# EasyEDA Pro project AcGunV2.eprj

# Schematic Schematic1
Create Date: 2022-08-31; Page Name: P1; Project Name: AcGunV2; Schematic Name: Schematic1; Update Date: 2022-12-06
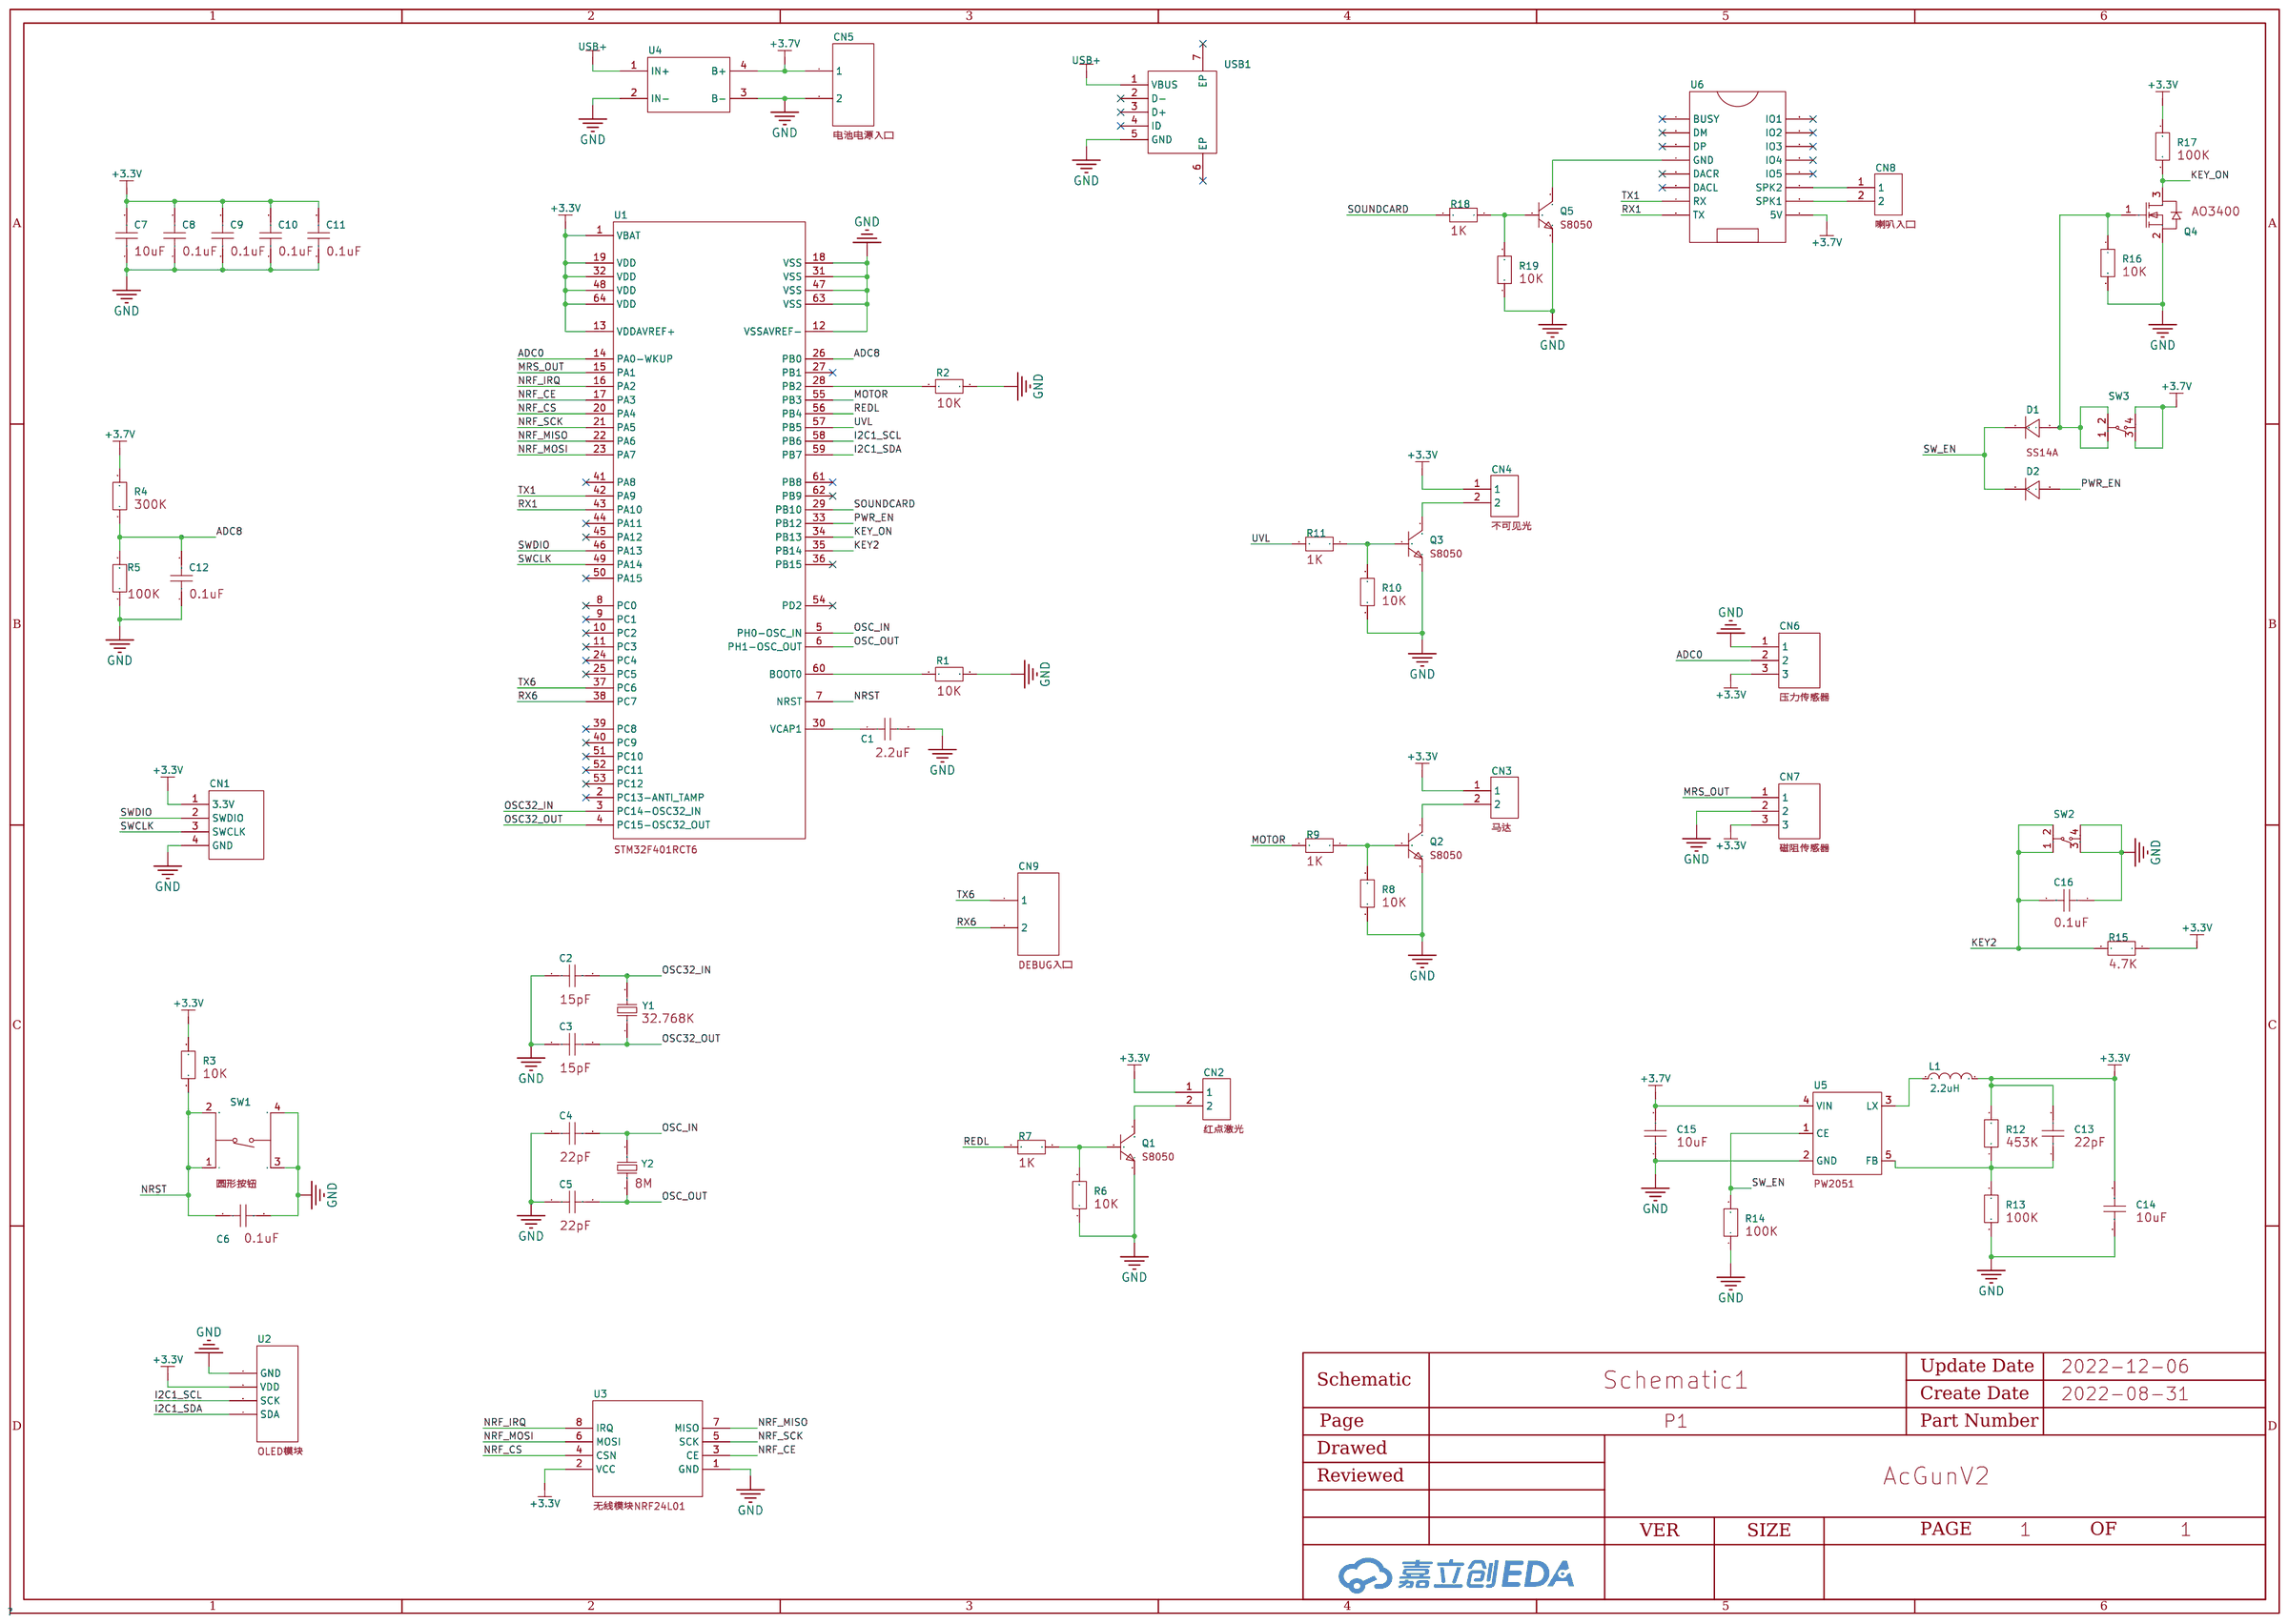
[diagram p0: schematic sheet]

## Parts
C1  -  [0603]
C2  -  [0603]
C3  -  [0603]
C4  -  [0603]
C5  -  [0603]
C6  -  [0603]
C7  -  [0603]
C8  -  [0603]
C9  -  [0603]
C10  -  [0603]
C11  -  [0603]
C12  -  [0603]
C13  -  [0603]
C14  -  [0603]
C15  -  [0603]
C16  -  [0603]
CN1  -  [烧录入口]
CN2  -  [2P接线点]
CN3  -  [2P接线点]
CN4  -  [2P接线点]
CN5  -  [XH2.54插件2P]
CN6  -  [3P接线点]
CN7  -  [3P接线点]
CN8  -  [2P接线点]
CN9  -  [XH2.54插件2P]
D1  SS14A  [SMA_L4.3-W2.6-LS5.2-RD]
D2  SS14A  [SMA_L4.3-W2.6-LS5.2-RD]
L1  2.2uH  [IND-SMD_L4.0-W4.0_0.47UH04209.5A]
Q1  S8050  [SOT-23_L2.9-W1.3-P1.90-LS2.4-BR]
Q2  S8050  [SOT-23_L2.9-W1.3-P1.90-LS2.4-BR]
Q3  S8050  [SOT-23_L2.9-W1.3-P1.90-LS2.4-BR]
Q4  AO3400  [SOT-23_L2.9-W1.3-P1.90-LS2.4-BR]
Q5  S8050  [SOT-23_L2.9-W1.3-P1.90-LS2.4-BR]
R1  -  [0603]
R2  -  [0603]
R3  -  [0603]
R4  -  [0603]
R5  -  [0603]
R6  -  [0603]
R7  -  [0603]
R8  -  [0603]
R9  -  [0603]
R10  -  [0603]
R11  -  [0603]
R12  -  [0603]
R13  -  [0603]
R14  -  [0603]
R15  -  [0603]
R16  -  [0603]
R17  -  [0603]
R18  -  [0603]
R19  -  [0603]
SW1  1TS001G-2700-1500-CT  [SW-SMD_4P-L5.1-W5.1-P3.70-LS6.5-TL-2]
SW2  -  [按钮开关]
SW3  -  [按钮开关]
U1  STM32F401RCT6  [LQFP-64_L10.0-W10.0-P0.50-LS12.0-BL]
U2  -  [OLED模块封装]
U3  -  [NRF24L01]
U4  -  [TP4056M]
U5  -  [SOT-23-5_L2.9-W1.6-P0.95-LS2.8-BR]
U6  -  [MY2480]
USB1  -  [MICRO-USB-TH_MICRO-USB-A14]
Y1  -  [3215]
Y2  -  [5032]

## Library data of the parts
C1 = 电容: 0603 标准贴片电容; Capacitance: 2.2uF
C2 C3 = 电容: 0603 标准贴片电容; Capacitance: 15pF
C4 C5 C13 = 电容: 0603 标准贴片电容; Capacitance: 22pF
C6 C8-C12 C16 = 电容: 0603 标准贴片电容; Capacitance: 0.1uF
C7 C14 C15 = 电容: 0603 标准贴片电容; Capacitance: 10uF
CN1 = 烧录入口
CN2 = 2P接线点: 红点激光
CN3 = 2P接线点: 马达
CN4 = 2P接线点: 不可见光
CN5 = XH2.54插件2P: 电池电源入口
CN6 = 3P接线点: 压力传感器
CN7 = 3P接线点: 磁阻传感器
CN8 = 2P接线点: 喇叭入口
CN9 = XH2.54插件2P: DEBUG入口
D1 D2 = SS14A: 直流反向耐压(Vr):40V;平均整流电流(Io):1A;正向压降(Vf):500mV@1A;; LCSC Part Name: 40V 1A 500mV@1A; Supplier Part: C211770; Manufacturer: YANGJIE(扬杰); Supplier Footprint: SMA(DO-214AC); JLCPCB Part Class: Extended Part; Datasheet: https://atta.szlcsc.com/upload/public/pdf/source/20180504/C211770_627C435F34E9C107E4A4301F69D28675.pdf; Supplier: LCSC; Reverse Voltage (Vr): 40V; Average Rectified Current (Io): 1A; Forward Voltage (Vf@If): 500mV@1A
L1 = 2.2uh3a电感: 电感值:2.2uH;精度:±20%;额定电流:3A;直流电阻(DCR):-;; Rated Current: 3A; Supplier: LCSC; Supplier Part: C438930; Supplier Footprint: SMD; LCSC Part Name: 2.2uH ±20% 3A; Tolerance: ±20%; Manufacturer: Cybermax(思博科技); Manufacturer Part: CMLO0420H2R2MTT
Q1-Q3 Q5 = S8050: 晶体管类型:NPN;集射极击穿电压(Vceo):25V;集电极电流(Ic):500mA;功率(Pd):625mW;集电极-发射极饱和电压(VCE(sat)@Ic,Ib):600mV@500mA,50mA;直流电流增益(hFE@Ic,Vce):200@100mA,1V;特征频率(fT):150MHz;工作温度:+150@(Tj);; LCSC Part Name: NPN 25V 500mA; Supplier Part: C414195; Manufacturer: GP(格瑞宝); Supplier Footprint: SOT-23; JLCPCB Part Class: Extended Part; Datasheet: https://atta.szlcsc.com/upload/public/pdf/source/20190828/C414195_F420B1E456405127F3181AB0586AEC6F.pdf; Supplier: LCSC; Transistor Type: NPN; Collector-Emitter Breakdown Voltage (Vceo): 25V; Collector Current (Ic): 500mA; Power Dissipation (Pd): 625mW; Collector-Emitter Saturation Voltage (VCE(sat)@Ic,Ib): 600mV@500mA,50mA; DC Current Gain (hFE@Ic,Vce): 200@100mA,1V; Transition Frequency (fT): 150MHz; Operating Temperature: +150@(Tj)
Q4 = AO3400: 类型:N沟道;漏源电压(Vdss):30V;连续漏极电流(Id):5.8A;功率(Pd):1.5W;导通电阻(RDS(on)@Vgs,Id):35mΩ@10V,5.8A;阈值电压(Vgs(th)@Id):1.2V@250uA;栅极电荷(Qg@Vgs):-;输入电容(Ciss@Vds):1050pF@15V;反向传输电容(Crss@Vds):77pF@15V;工作温度:+150@(Tj);; LCSC Part Name: N沟道 30V 5.8A; Supplier Part: C2938367; Manufacturer: GOODWORK(固得沃克); Supplier Footprint: SOT23; JLCPCB Part Class: Extended Part; Datasheet: https://atta.szlcsc.com/upload/public/pdf/source/20211229/1DE691E24B5B31BB262C463D0489A9AB.pdf; Supplier: LCSC; Type: N沟道; Drain Source Voltage (Vdss): 30V; Continuous Drain Current (Id): 5.8A; Power Dissipation (Pd): 1.5W; Drain Source On Resistance (RDS(on)@Vgs,Id): 35mΩ@10V,5.8A; Gate Threshold Voltage (Vgs(th)@Id): 1.2V@250uA; Input Capacitance (Ciss@Vds): 1050pF@15V; Reverse Transfer Capacitance (Crss@Vds): 77pF@15V; Operating Temperature: +150@(Tj)
R1-R3 R6 R8 R10 R16 R19 = 电阻: 0603 标准贴片电阻; Resistance: 10K
R4 = 电阻: 0603 标准贴片电阻; Resistance: 300K
R5 R13 R14 R17 = 电阻: 0603 标准贴片电阻; Resistance: 100K
R7 R9 R11 R18 = 电阻: 0603 标准贴片电阻; Resistance: 1K
R12 = 电阻: 0603 标准贴片电阻; Resistance: 453K
R15 = 电阻: 0603 标准贴片电阻; Resistance: 4.7K
SW1 = 1TS001G-2700-1500-CT: 触点电流:20mA;额定电压(DC):12V;电路结构:单刀单掷;安装方式:立贴;按钮形状:圆形按钮;带灯:-;开关长度:5.1mm;开关宽度:5.1mm;开关高度:0.3mm;; LCSC Part Name: 铜头按钮; Supplier Part: C318800; Manufacturer: HYP(鸿源精密); Supplier Footprint: SMD,5.1x5.1mm; JLCPCB Part Class: Extended Part; Datasheet: https://atta.szlcsc.com/upload/public/pdf/source/20200109/C318800_E3EE45BECD3EEEC6701309AC007B685B.pdf; Supplier: LCSC; Contact Current: 20mA; Voltage Rating (DC): 12V; Circuit: 单刀单掷; Mounting Style: 立贴; Actuator Style: 圆形按钮; Switch Length: 5.1mm; Switch Width: 5.1mm; Switch Height: 0.3mm
SW2 SW3 = 按键开关
U1 = STM32F401RCT6: 主频（MAX):84MHz;工作电压:1.7V ~ 3.6V;; Supplier Part: C74524; Manufacturer: ST(意法半导体); Supplier Footprint: LQFP-64_10x10x05P; JLCPCB Part Class: Extended Part; Datasheet: https://atta.szlcsc.com/upload/public/pdf/source/20170728/C74524_1501225886278849063.pdf; Supplier: LCSC; Speed: 84MHz; Voltage - Supply (Vcc/Vdd): 1.7V ~ 3.6V; Program Memory Size: 256KB; RAM Size: 64KB; Number of I/O: 50; A/D: 16x12bit; PWM: 32; UART/USART: 3 USART; SPI: 3; I2C（SMBUS/PMBUS）: 2; USB Device: 1; USB Host/OTG: 1
U2 = 长型OLED屏幕: OLED模块
U3 = NRF24L01: 无线模块NRF24L01
U4 = TP4056M
U5 = PW2051: Supplier: LCSC; Supplier Part: C9900004763; Supplier Footprint: SOT23-5; JLCPCB Part Class: Extended Part; Datasheet: 2021-12-24/856123Z/fbe1facec1e64a42b88c21fe7c936e8d/PW2051.pdf
U6 = MY2480: MY2480发声模块
USB1 = 立式USB插口: 连接器类型:Micro-B;标准:USB 2.0;公母:母座;触点数量:5;端口数量:1;; Supplier: LCSC; Supplier Part: C145795; Supplier Footprint: 插件; JLCPCB Part Class: Extended Part; LCSC Part Name: Micro-B 母座; Datasheet: https://atta.szlcsc.com/upload/public/pdf/source/20190321/C145795_7870B82BC79666CAD2740B4BEFFA2B3B.pdf; Manufacturer: 韩国韩荣; Manufacturer Part: U-D-M5DD-W-1; Connector Type: Micro-B; Gender: 母座; Number of Contacts: 5; Number of Ports: 1; Standard: USB 2.0
Y1 = 32.768KHz晶振: Frequency: 32.768K
Y2 = 8MHz晶振: Capacitance: 8M

## Nets
+3.3V: C7.2 C8.2 C9.2 C10.2 C11.2 C13.2 C14.2 CN1.1(3.3V) CN2.1 CN3.1 CN4.1 CN6.3 CN7.3 L1.2 R3.2 R12.2 R15.1 R17.1 U1.1(VBAT) U1.13(VDDAVREF+) U1.19(VDD) U1.32(VDD) U1.48(VDD) U1.64(VDD) U2.2(VDD) U3.2(VCC)
+3.7V: C15.2 CN5.1 R4.2 SW3.3(C) SW3.4(D) U4.4(B+) U5.4(VIN) U6.9(5V)
GND: C1.2 C2.1 C3.1 C4.1 C5.1 C6.2 C7.1 C8.1 C9.1 C10.1 C11.1 C12.1 C14.1 C15.1 C16.1 CN1.4(GND) CN5.2 CN6.1 CN7.2 Q1.2(E) Q2.2(E) Q3.2(E) Q4.2(S) Q5.2(E) R1.2 R2.2 R5.1 R6.1 R8.1 R10.1 R13.1 R14.1 R16.2 R19.1 SW1.3(C) SW1.4(D) SW2.3(C) SW2.4(D) U1.12(VSSAVREF-) U1.18(VSS) U1.31(VSS) U1.47(VSS) U1.63(VSS) U2.1(GND) U3.1(GND) U4.2(IN-) U4.3(B-) U5.2(GND) USB1.5(GND)
ADC0: CN6.2 U1.14(PA0-WKUP)
ADC8: C12.2 R4.1 R5.2 U1.26(PB0)
I2C1_SCL: U1.58(PB6) U2.3(SCK)
I2C1_SDA: U1.59(PB7) U2.4(SDA)
KEY2: C16.2 R15.2 SW2.1(A) SW2.2(B) U1.35(PB14)
KEY_ON: Q4.3(D) R17.2 U1.34(PB13)
MOTOR: R9.2 U1.55(PB3)
MRS_OUT: CN7.1 U1.15(PA1)
NRF_CE: U1.17(PA3) U3.3(CE)
NRF_CS: U1.20(PA4) U3.4(CSN)
NRF_IRQ: U1.16(PA2) U3.8(IRQ)
NRF_MISO: U1.22(PA6) U3.7(MISO)
NRF_MOSI: U1.23(PA7) U3.6(MOSI)
NRF_SCK: U1.21(PA5) U3.5(SCK)
NRST: C6.1 R3.1 SW1.1(A) SW1.2(B) U1.7(NRST)
OSC32_IN: C2.2 U1.3(PC14-OSC32_IN) Y1.2
OSC32_OUT: C3.2 U1.4(PC15-OSC32_OUT) Y1.1
OSC_IN: C4.2 U1.5(PH0-OSC_IN) Y2.2
OSC_OUT: C5.2 U1.6(PH1-OSC_OUT) Y2.1
PWR_EN: D2.2(A) U1.33(PB12)
REDL: R7.2 U1.56(PB4)
RX1: U1.43(PA10) U6.8(TX)
RX6: CN9.2 U1.38(PC7)
SOUNDCARD: R18.2 U1.29(PB10)
SW_EN: D1.1(C) D2.1(C) R14.2 U5.1(CE)
SWCLK: CN1.3(SWCLK) U1.49(PA14)
SWDIO: CN1.2(SWDIO) U1.46(PA13)
TX1: U1.42(PA9) U6.7(RX)
TX6: CN9.1 U1.37(PC6)
USB+: U4.1(IN+) USB1.1(VBUS)
UVL: R11.2 U1.57(PB5)
$1N1304: C1.1 U1.30(VCAP1)
$1N1668: R1.1 U1.60(BOOT0)
$1N1829: R2.1 U1.28(PB2)
$1N9984: CN2.2 Q1.3(C)
$1N10713: Q1.1(B) R6.2 R7.1
$1N11694: CN3.2 Q2.3(C)
$1N11697: Q2.1(B) R8.2 R9.1
$1N12643: CN4.2 Q3.3(C)
$1N12646: Q3.1(B) R10.2 R11.1
$1N15476: L1.1 U5.3(LX)
$1N15617: C13.1 R12.1 R13.2 U5.5(FB)
$1N23471: D1.2(A) Q4.1(G) R16.1 SW3.1(A) SW3.2(B)
$1N28745: Q5.1(B) R18.1 R19.2
$1N30076: Q5.3(C) U6.4(GND)
$1N30362: CN8.1 U6.11(SPK2)
$1N30425: CN8.2 U6.10(SPK1)

Not connected (* = marked no-connect by the designer): U1 2(PC13-ANTI_TAMP)* 8(PC0)* 9(PC1)* 10(PC2)* 11(PC3)* 24(PC4)* 25(PC5)* 27(PB1)* 36(PB15)* 39(PC8)* 40(PC9)* 41(PA8)* 44(PA11)* 45(PA12)* 50(PA15)* 51(PC10)* 52(PC11)* 53(PC12)* 54(PD2)* 61(PB8)* 62(PB9)*; U6 1(BUSY)* 2(DM)* 3(DP)* 5(DACR)* 6(DACL)* 12(IO5)* 13(IO4)* 14(IO3)* 15(IO2)* 16(IO1)*; USB1 2(D-)* 3(D+)* 4(ID)* 6(EP)* 7(EP)*

# Board PCB1
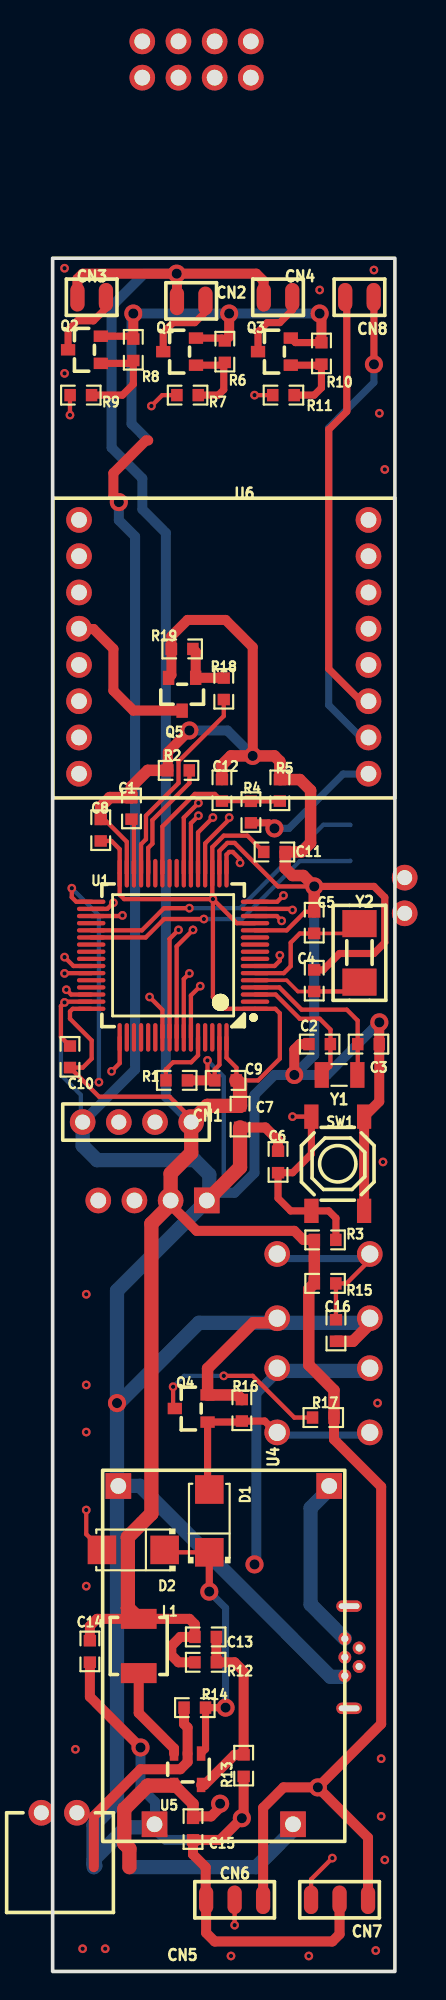
[diagram p1: board, top side]
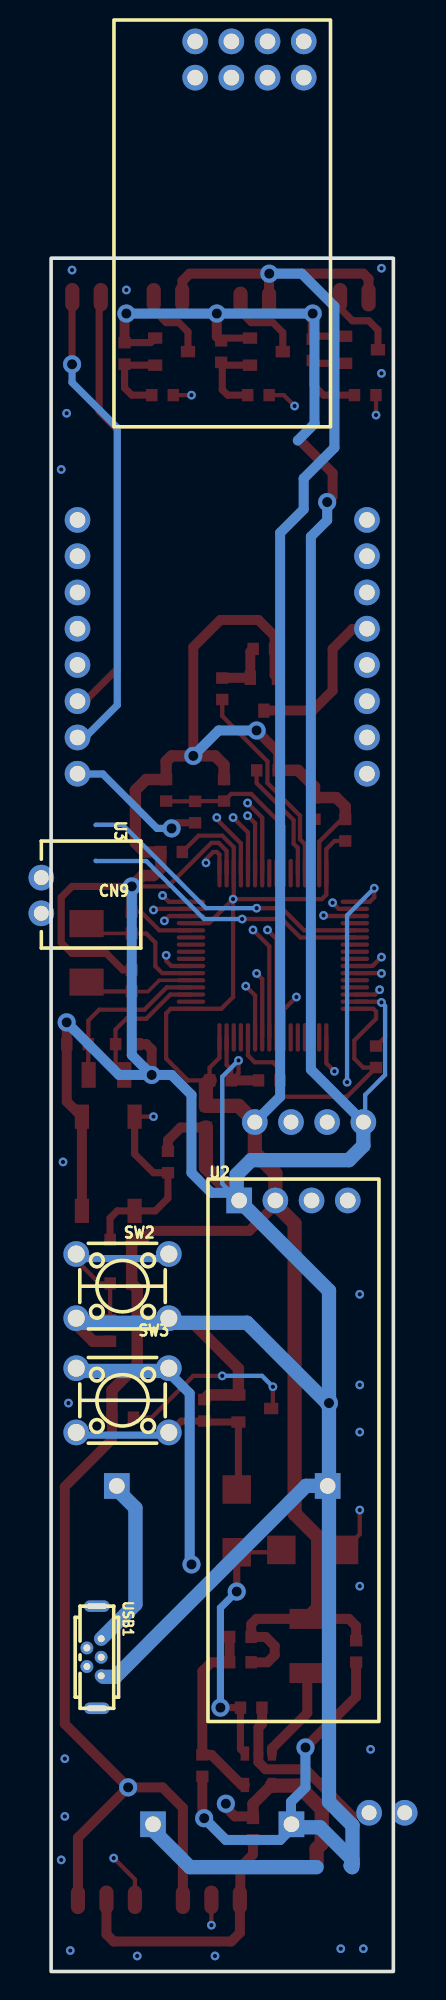
[diagram p2: board, bottom side, seen from below]

Outline 24.02 x 120.02 mm; copper layers: Top Layer, CPU1, CPU2, Bottom Layer. Coordinates in mm from the lower left corner of the outline.
Outline path: rectangle 0,120.02 24.02,0
Stack: Top Layer 0.035mm / Dielectric1 0.48mm PP er 4.5 / CPU1 0.035mm / Dielectric2 0.48mm FR4 er 4.5 / CPU2 0.035mm / Dielectric3 0.48mm PP er 4.5 / Bottom Layer 0.035mm

## Design rules (mm)
spacing safeClearance (default): track to track 0.152, other pairs 0.152 to 0.3
track width trackWidth (default): min 0.127, default 0.254, max 2.54
differential pair differentialPair (default): width min 0.127, default 0.254, max 2.54; gap min 0.152, default 0.152
via viaSize (default): diameter min 0.5, default 0.61, max 10; hole min 0.3, default 0.305, max 6

## Placement (name value [footprint] x y rotation side)
C1  -  [0603]  5.53 81.48 90 top
C2  -  [0603]  18.74 64.97 0 top
C3  -  [0603]  22.17 64.97 180 top
C4  -  [0603]  18.36 69.41 270 top
C5  -  [0603]  18.36 73.47 270 top
C6  -  [0603]  15.82 56.71 90 top
C7  -  [0603]  13.16 59.89 90 top
C8  -  [0603]  3.38 79.95 270 top
C9  -  [0603]  12.14 62.43 0 top
C10  -  [0603]  1.22 64.08 270 top
C11  -  [0603]  15.57 78.43 180 top
C12  -  [0603]  11.88 82.75 270 top
C13  -  [0603]  10.74 23.44 180 top
C14  -  [0603]  2.61 22.42 90 top
C15  -  [0603]  9.85 9.97 90 top
C16  -  [0603]  19.89 44.9 90 top
CN1  -  [烧录入口]  9.73 59.5 180 top
CN2  -  [2P接线点]  9.73 117.03 0 top
CN3  -  [2P接线点]  2.74 117.29 0 top
CN4  -  [2P接线点]  15.82 117.29 0 top
CN5  -  [XH2.54插件2P]  0.45 7.31 0 top
CN6  -  [3P接线点]  12.77 5.02 0 top
CN7  -  [3P接线点]  20.14 5.02 0 top
CN8  -  [2P接线点]  21.54 117.29 0 top
CN9  -  [XH2.54插件2P]  20.9 75.38 90 bottom
D1  SS14A  [SMA_L4.3-W2.6-LS5.2-RD]  11 31.56 90 top
D2  SS14A  [SMA_L4.3-W2.6-LS5.2-RD]  5.66 29.53 180 top
L1  2.2uH  [IND-SMD_L4.0-W4.0_0.47UH04209.5A]  6.04 22.8 90 top
Q1  S8050  [SOT-23_L2.9-W1.3-P1.90-LS2.4-BR]  8.91 113.48 0 top
Q2  S8050  [SOT-23_L2.9-W1.3-P1.90-LS2.4-BR]  2.23 113.61 0 top
Q3  S8050  [SOT-23_L2.9-W1.3-P1.90-LS2.4-BR]  15.57 113.48 0 top
Q4  AO3400  [SOT-23_L2.9-W1.3-P1.90-LS2.4-BR]  9.73 39.44 0 top
Q5  S8050  [SOT-23_L2.9-W1.3-P1.90-LS2.4-BR]  9.09 89.48 90 top
R1  -  [0603]  8.71 62.43 0 top
R2  -  [0603]  8.84 84.14 180 top
R3  -  [0603]  19.12 51.25 180 top
R4  -  [0603]  13.92 81.22 270 top
R5  -  [0603]  15.95 82.75 270 top
R6  -  [0603]  12.09 113.48 270 top
R7  -  [0603]  9.47 110.43 180 top
R8  -  [0603]  5.66 113.61 270 top
R9  -  [0603]  1.98 110.43 180 top
R10  -  [0603]  18.87 113.35 270 top
R11  -  [0603]  16.2 110.43 180 top
R12  -  [0603]  10.74 21.66 180 top
R13  -  [0603]  13.41 14.42 90 top
R14  -  [0603]  9.98 18.48 0 top
R15  -  [0603]  19.12 48.2 0 top
R16  -  [0603]  13.28 39.31 90 top
R17  -  [0603]  19 38.8 180 top
R18  -  [0603]  12.01 89.86 270 top
R19  -  [0603]  9.09 92.65 0 top
SW1  1TS001G-2700-1500-CT  [SW-SMD_4P-L5.1-W5.1-P3.70-LS6.5-TL-2]  20.01 56.58 90 top
SW2  -  [按钮开关]  19.01 48.01 180 bottom
SW3  -  [按钮开关]  19.01 40.01 0 bottom
U1  STM32F401RCT6  [LQFP-64_L10.0-W10.0-P0.50-LS12.0-BL]  8.46 71.19 90 top
U2  -  [OLED模块封装]  13.01 55.51 180 bottom
U3  -  [NRF24L01]  19.61 108.71 90 bottom
U4  -  [TP4056M]  20.51 35.11 270 top
U5  -  [SOT-23-5_L2.9-W1.6-P0.95-LS2.8-BR]  9.47 14.16 90 top
U6  -  [MY2480]  12.01 103.21 0 top
USB1  -  [MICRO-USB-TH_MICRO-USB-A14]  21.01 22.01 270 bottom
Y1  -  [3215]  20.14 62.81 180 top
Y2  -  [5032]  21.54 71.31 270 top

## Footprints (pads in the part's own frame, mm; a bottom-side part is the same pattern mirrored in y, then rotated)
2P接线点
  oval 1x2 smd: 1(-1,0) 2(1,0)
3P接线点
  oval 1x2 smd: 1(-2,0) 2(0,0) 3(2,0)
0603
  rect 0.806x0.864 smd: 1(-0.753,0) 2(0.753,0)
3215
  rect 1x1.8 smd: 1(-1.25,0) 2(1.25,0)
5032
  rect 1.9x2.401 smd: 1(-2.093,0) 2(2.007,0)
IND-SMD_L4.0-W4.0_0.47UH04209.5A
  rect 1.399x2.499 smd: 1(-1.9,0) 2(1.9,0)
LQFP-64_L10.0-W10.0-P0.50-LS12.0-BL
  oval 0.3x2 smd: 1(-3.75,-5.75) 2(-3.25,-5.75) 3(-2.75,-5.75) 4(-2.25,-5.75) 5(-1.75,-5.75) 6(-1.25,-5.75) 7(-0.75,-5.75) 8(-0.25,-5.75) 9(0.25,-5.75) 10(0.75,-5.75) 11(1.25,-5.75) 12(1.75,-5.75) 13(2.25,-5.75) 14(2.75,-5.75) 15(3.25,-5.75) 16(3.75,-5.75) 33(3.75,5.75) 34(3.25,5.75) 35(2.75,5.75) 36(2.25,5.75) 37(1.75,5.75) 38(1.25,5.75) 39(0.75,5.75) 40(0.25,5.75) 41(-0.25,5.75) 42(-0.75,5.75) 43(-1.25,5.75) 44(-1.75,5.75) 45(-2.25,5.75) 46(-2.75,5.75) 47(-3.25,5.75) 48(-3.75,5.75)
  oval 2x0.3 smd: 17(5.75,-3.75) 18(5.75,-3.25) 19(5.75,-2.75) 20(5.75,-2.25) 21(5.75,-1.75) 22(5.75,-1.25) 23(5.75,-0.75) 24(5.75,-0.25) 25(5.75,0.25) 26(5.75,0.75) 27(5.75,1.25) 28(5.75,1.75) 29(5.75,2.25) 30(5.75,2.75) 31(5.75,3.25) 32(5.75,3.75) 49(-5.75,3.75) 50(-5.75,3.25) 51(-5.75,2.75) 52(-5.75,2.25) 53(-5.75,1.75) 54(-5.75,1.25) 55(-5.75,0.75) 56(-5.75,0.25) 57(-5.75,-0.25) 58(-5.75,-0.75) 59(-5.75,-1.25) 60(-5.75,-1.75) 61(-5.75,-2.25) 62(-5.75,-2.75) 63(-5.75,-3.25) 64(-5.75,-3.75)
MICRO-USB-TH_MICRO-USB-A14
  round 0.899 hole 0.5: 1(-1.3,0.5) 2(-0.65,-0.5) 3(0,0.5) 4(0.65,-0.5) 5(1.3,0.5)
  oval 0.8x1.801 hole 0.399x1.45: 6(-3.579,0.201) 7(3.579,0.201)
MY2480
  round 1.8 hole 1.1: 1(-10.16,-1.524) 2(-10.16,-4.064) 3(-10.16,-6.604) 4(-10.16,-9.144) 5(-10.16,-11.684) 6(-10.16,-14.224) 7(-10.16,-16.764) 8(-10.16,-19.304) 9(10.16,-19.304) 10(10.16,-16.764) 11(10.16,-14.224) 12(10.16,-11.684) 13(10.16,-9.144) 14(10.16,-6.604) 15(10.16,-4.064) 16(10.16,-1.524)
NRF24L01
  round 1.8 hole 1.1: 1(26.5,-13.32) 2(23.96,-13.32) 3(26.5,-10.78) 4(23.96,-10.78) 5(26.5,-8.24) 6(23.96,-8.24) 7(26.5,-5.7) 8(23.96,-5.7)
OLED模块封装
  rect 1.8x1.8 hole 1.1: 1(2.19,-1.5)
  round 1.8 hole 1.1: 2(4.73,-1.5) 3(7.27,-1.5) 4(9.81,-1.5)
SMA_L4.3-W2.6-LS5.2-RD
  rect 2x2 smd: 1(-2.2,0) 2(2.2,0)
SOT-23-5_L2.9-W1.6-P0.95-LS2.8-BR
  rect 1.001x0.6 smd: 1(1.1,-0.95) 2(1.1,0) 3(1.1,0.95) 4(-1.1,0.95) 5(-1.1,-0.95)
SOT-23_L2.9-W1.3-P1.90-LS2.4-BR
  rect 1x0.8 smd: 1(1.15,-0.95) 2(1.15,0.95) 3(-1.15,0)
SW-SMD_4P-L5.1-W5.1-P3.70-LS6.5-TL-2
  rect 1.7x1 smd: 1(-3.3,1.849) 2(3.3,1.851) 3(-3.3,-1.851) 4(3.3,-1.851)
TP4056M
  rect 1.8x1.8 hole 1.1: 1(1.1,-1.1) 2(1.1,-15.9) 3(24.8,-13.36) 4(24.8,-3.64)
XH2.54插件2P
  round 1.8 hole 1.05: 1(1.25,3.81) 2(-1.25,3.81)
按钮开关
  round 1.8 hole 1.2: 1(-3.25,2.25) 2(3.25,2.25) 3(-3.25,-2.25) 4(3.25,-2.25)
烧录入口
  round 1.8 hole 1.05: 1(0,0) 2(2.54,0) 3(5.08,0) 4(7.62,0)

## Nets
As in the schematic.

Pads without a net: U1 2 8 9 10 11 24 25 27 36 39 40 41 44 45 50 51 52 53 54 61 62; U6 1 2 3 5 6 12 13 14 15 16; USB1 2 3 4 6 7

## Via types
v1: diameter 1.27, hole 0.711, Top Layer to Bottom Layer, 20 vias
v2: diameter 0.61, hole 0.305, Top Layer to Bottom Layer, 58 vias

## Routing (per net, layer and track width the routed paths; a pad name or vN(x,y) marks a point on that pad's centre or on a via; arc(x,y) is an arc through that point)
+3.3V: length 276
  Top Layer w0.3: U1.64 12.21,64.01 12.9,63.31 12.9,62.43 C9.2 ; v2(11.25,75.12) 12.94,73.44 U1.13 ; v2(11.25,75.12) 11.21,75.17 U1.19 11.21,78.76 12.01,79.57 13.67,79.57 C11.2 ; v2(11.25,75.12) 5.02,75.12 4.71,75.44 U1.32 4.71,78.62 4.13,79.2 C8.2 ; v2(11.25,75.12) 11.25,68.27 12.08,67.44 U1.1 15.63,67.44 15.95,67.12 15.95,63.95 14.42,62.43 12.91,62.43 ; 9.73,59.76 8.2,61.28 3.26,61.28 C10.2 2.11,63.32 2.74,63.95 2.74,65.22 1.22,66.74 1.22,67.25 1.4,67.44 U1.48
  Top Layer w0.7: R12.2 8.84,21.66 8.33,22.17 8.33,22.8 8.96,23.44 C13.2 9.98,23.44 9.98,24.33 9.6,24.7 L1.2 3.12,24.7 2.61,24.2 C14.2 ; v1(18.62,12.9) 16.2,12.9 14.77,11.47 CN6.3 ; v1(18.62,12.9) 22.14,9.37 CN7.3 ; v1(18.62,12.9) 23.06,17.34 23.06,33.96 19.75,37.27 R17.1 ; CN3.1 1.74,118.58 2.11,118.94 v1(8.71,118.94) ; CN4.1 14.81,117.31 14.81,118.43 14.3,118.94 8.73,118.94 8.73,117.29 ; 8.46,53.92 8.46,53.54 10.11,51.88 16.97,51.88 17.6,51.25 R3.2
  Top Layer w0.8: R17.1 19.75,40.72 17.98,42.49 17.98,47.81 R15.1 R3.2
  Top Layer w1: L1.2 5.28,25.46 5.28,30.42 6.93,32.07 6.93,52.39 8.46,53.92 8.28,54.04 ; 8.28,54.04 U2.2 ; 8.28,54.04 8.28,55.9 9.73,57.34 CN1.1 10.86,60.64 C7.2 13.16,62.16 C9.2
  Bottom Layer w0.7: v1(8.71,118.94) 6.42,118.94 4.14,116.65 4.14,106.75 6.3,104.59 6.3,102.43 7.95,100.78 7.95,61.28 CN1.1
+3.7V: length 115
  Top Layer w0.5: v1(15.57,80.08) 15.18,80.47 R4.2
  Top Layer w0.7: C15.2 9.99,10.86 11.12,10.86 11.76,11.5 v1(11.76,11.75)
  Top Layer w0.8: C15.2 9.85,11.73 U5.4
  Top Layer w1: U5.4 8.48,13.02 6.68,13.02 5.03,11.37 5.03,8.96 5.39,8.6 5.39,7.31
  CPU2 w0.5: 15.87,42.07 13.92,44.03 13.92,78.43 v1(15.57,80.08)
  CPU2 w0.7: v1(11.76,11.75) 14.17,14.16 v1(14.17,28.52)
  Bottom Layer w0.5: v1(15.57,80.08) 16.58,80.08 20.39,83.89 22.68,83.89
  Bottom Layer w0.7: v1(14.17,28.52) 14.3,28.64 14.3,40.49 15.87,42.07
  Bottom Layer w1: 5.39,7.31 14.28,7.31 16.95,9.97 ; 15.87,42.07 22.37,42.07
GND: length 452.5
  Top Layer w0.3: C8.1 3.64,80.7 5.21,79.14 U1.31 ; U1.47 0.89,67.94 0.58,67.63 0.58,65.46 C10.1 ; v2(10.87,63.82) 10.87,62.94 11.38,62.43 ; C5.1 18.35,74.24 17.73,74.24 16.43,72.94 U1.12 ; v1(18.36,76.01) 15.82,76.01 12.77,79.06 12.27,79.06 11.71,78.5 U1.18 ; U1.63 11.71,63.52 11.38,63.19 11.38,62.43 ; C9.1 11.38,62.43
  Top Layer w0.5: Q1.2 11.89,114.43 12.09,114.23 ; C4.1 18.99,70.16 20.14,71.31 22.55,71.31 23.31,72.08 23.31,75.25 22.55,76.01 v1(18.36,76.01) ; R8.1 5.47,114.56 Q2.2 ; Q3.2 17.03,114.11 18.86,114.11 R10.1
  Top Layer w0.7: CN7.2 20.14,2.61 19.63,2.1 11.38,2.1 10.77,2.7 CN6.1 10.74,5.05 10.74,7.31 9.85,8.2 C15.1 9.86,9.21 11.76,9.21 13.41,10.86 R13.1 ; 2.89,7.31 2.89,10.88 6.17,14.16 8.96,14.16 9.47,14.67 9.47,17.09 9.22,17.34 9.22,18.47 R14.1 ; v1(9.6,86.94) 8.08,85.42 R2.2 ; v1(22.93,66.49) 22.93,66.48 C3.1 22.93,60.95 SW1.4 SW1.3 ; C2.1 17.35,64.97 16.97,64.58 v1(16.97,62.81) ; v1(18.74,116.15) 18.87,116.02 18.87,114.12 18.86,114.11 ; C6.2 15.82,58.23 14.93,59.12 13.16,59.12 C7.1 ; R1.2 C9.1 ; Q5.2 8.34,90.82 R19.1 8.34,93.55 9.47,94.68 12.14,94.68 14.04,92.78 v1(14.04,85.16) ; 12.09,114.23 12.39,114.54 v1(12.39,116.15) ; C14.1 2.61,19.25 v1(6.17,15.69) ; v1(4.65,102.94) 4.26,103.32 4.26,104.97 6.55,107.26 6.71,107.26 ; R8.1 v1(5.66,116.15)
  Top Layer w0.8: C8.1 3.38,81.6 4.01,82.24 5.53,82.24 C1.2 5.53,83 6.68,84.14 R2.2 ; 15.87,45.44 14.08,45.44 10.88,42.24 Q4.2 12.96,40.39 R16.2 ; C16.1 21.08,44.15 22.37,45.44 ; C12.1 11.88,84.52 12.52,85.16 v1(14.04,85.16) 15.57,85.16 15.95,84.78 R5.1 17.35,83.5 18.11,82.75 18.11,79.06 17.47,78.43 C11.1 16.32,77.29 16.84,76.78 17.6,76.78 v1(18.36,76.01) C5.1
  Top Layer w1: C7.1 13.16,56.33 11,54.17
  Bottom Layer w0.3: v2(0.84,67.89) 0.58,67.63 0.58,62.81 1.98,61.41 1.98,59.63 CN1.4 ; v2(10.87,63.82) 12.01,62.68 12.01,55.19 11.38,54.55
  Bottom Layer w0.7: v1(16.97,62.81) 18.36,64.2 v1(18.36,76.01) ; v1(16.97,62.81) 15.57,62.81 14.17,61.41 14.17,55.95 12.77,54.55 11.38,54.55 11,54.17 ; v1(16.97,62.81) 19.25,62.81 v1(22.93,66.49) ; v1(18.74,116.15) v1(12.39,116.15) v1(5.66,116.15) 5.53,116.02 5.53,108.43 6.71,107.26 ; CN1.4 5.79,63.19 5.79,100.53 4.65,101.67 v1(4.65,102.94) ; v1(14.04,85.16) 12.27,86.94 v1(9.6,86.94) ; 6.29,9.98 6.48,10.1 6.84,10.32 7.95,9.21 11.76,9.21 v1(13.28,10.74) ; 7.19,10.35 7.19,11.88 6.17,12.9 v1(6.17,15.69)
  Bottom Layer w1: 4.52,39.69 4.5,39.68 ; 4.52,39.69 v1(4.52,39.82) 4.52,47.69 11,54.17 11,55.82 9.98,56.84 3.12,56.84 2.11,57.85 CN1.4 ; 4.52,39.69 4.52,34.02 ; 4.52,39.69 10.27,45.44 22.37,45.44 ; U4.3 6.94,10.1 5.15,10.1 2.89,7.84 2.89,7.52 ; 2.89,7.52 3,7.41 2.89,7.31 2.89,7.52 ; 2.89,7.52 2.87,7.54 2.87,10.23 4.52,11.88 4.52,34.02 ; 4.52,34.02 6.13,34.02 19.5,20.64 20.37,20.64
  vias: v2(0.84,119.32) v2(0.84,111.96) v2(1.6,15.56) v2(1.6,10.74) v2(2.11,1.59) v2(2.36,47.44) v2(2.36,41.09) v2(2.36,37.79) v2(2.36,26.99) v2(3.69,1.59) v2(12.52,1.08) v2(17.98,1.08) v2(18.74,117.8) v2(22.55,119.19) v2(22.68,1.47) v2(22.81,39.82) v2(22.93,109.16) v2(23.06,14.91) v2(23.06,10.86) v2(23.19,56.71) v2(23.31,105.22) v2(23.31,7.81)
ADC0: length 77.2
  Top Layer w0.3: U1.14 15.74,73.94 v2(16.08,73.6) ; v2(12.77,3.24) CN6.2
  CPU1 w0.3: v2(16.08,73.6) 18.11,71.57 18.11,36.52 15.44,33.85 15.44,7.56 12.77,4.89 v2(12.77,3.24)
ADC8: length 12.7
  Top Layer w0.3: R5.2 15.93,81.97 R4.1 13.9,81.99 C12.2 11.39,82.49 9.98,82.49 7.71,80.22 U1.26
I2C1_SCL: length 25.9
  Top Layer w0.3: v2(9.6,69.92) 9.21,69.53 U1.58
  CPU2 w0.3: 5.79,54.04 5.79,55.19 7.06,56.46 10.74,56.46 11.63,57.34 11.63,59.76 9.6,61.79 v2(9.6,69.92)
I2C1_SDA: length 33.9
  Top Layer w0.3: U1.59 9.71,68.37 v2(10.36,69.03)
  CPU2 w0.3: 3.12,54.42 3.12,52.14 3.88,51.38 11.25,51.38 12.77,52.9 12.77,66.62 v2(10.36,69.03)
KEY2: length 47.1
  Top Layer w0.3: U1.35 4.86,73.94 v2(4.9,73.98) ; C16.2 19.89,48.19 R15.2 20.63,48.2 22.37,49.94
  CPU1 w0.254: v2(4.9,73.98) 4.9,62.55 6.17,61.28 13.03,61.28 15.82,58.49 15.82,50 15.87,49.94
  Bottom Layer w0.5: 22.37,49.94 15.87,49.94
KEY_ON: length 54.4
  Top Layer w0.3: v2(12.01,41.72) 14.04,41.72 16.97,38.8 R17.2 ; v2(8.46,40.96) 8.46,39.56 Q4.3 ; U1.34 3.83,74.44 v2(4.26,74.87)
  CPU1 w0.3: v2(4.26,74.87) 4.26,64.46 0.71,60.9 0.71,46.68 6.42,40.96 v2(8.46,40.96)
  Bottom Layer w0.3: v2(8.46,40.96) 9.22,41.72 v2(12.01,41.72)
MOTOR: length 49.3
  Top Layer w0.3: U1.55 7.71,67.37 v2(6.81,68.27) ; v2(1.22,109.03) 1.22,110.42 R9.2
  CPU1 w0.3: v2(1.22,109.03) 3.12,109.03 4.14,108.02 4.14,105.61 3.5,104.97 3.5,100.78 6.81,97.48 v2(6.81,68.27)
MRS_OUT: length 74.9
  Top Layer w0.3: v2(19.63,7.94) 18.14,6.45 CN7.1 ; v2(16.84,74.36) 16.76,74.44 U1.15
  CPU1 w0.3: v2(19.63,7.94) 20.01,8.32 20.01,13.78 17.98,15.82 17.98,35.12 19,36.14 19,72.2 v2(16.84,74.36)
NRF_CE: length 45.9
  Top Layer w0.3: v2(13.16,77.67) 13.16,77.92 12.65,78.43 12.39,78.43 12.21,78.24 U1.17
  CPU1 w0.3: 8.83,107.15 8.84,107.16 8.84,108.4 9.98,109.54 16.08,109.54 17.35,108.27 17.35,85.92 13.16,81.73 v2(13.16,77.67)
NRF_CS: length 30.3
  Top Layer w0.3: U1.20 10.71,79.03 12.39,80.71 v2(12.39,80.84)
  CPU2 w0.3: 8.83,104.61 12.9,100.54 12.9,81.35 v2(12.39,80.84)
NRF_IRQ: length 33.2
  Top Layer w0.3: v2(16.2,75.38) 15.76,74.94 U1.16
  CPU2 w0.3: v2(16.2,75.38) 17.22,76.4 17.22,101.29 14.33,104.18 14.33,104.2 13.91,104.61
NRF_MISO: length 34.8
  Top Layer w0.3: v2(10.23,80.97) 9.71,80.44 U1.22
  CPU1 w0.3: v2(10.23,80.97) 12.52,83.25 12.52,85.67 13.66,86.81 14.55,86.81 16.08,88.33 16.08,105.1 13.92,107.26 14.33,107.26
NRF_MOSI: length 28.8
  Top Layer w0.3: v2(10.23,81.86) 9.21,80.83 U1.23
  CPU1 w0.3: v2(10.23,81.86) 11.38,83 11.38,104.3 11.79,104.72
NRF_SCK: length 40.1
  Top Layer w0.3: v2(11.25,80.84) 10.21,79.8 U1.21
  CPU1 w0.3: v2(11.25,80.84) 16.71,86.3 16.71,107.89 15.57,109.03 13.28,109.03 11.5,107.26
NRST: length 28.7
  Top Layer w0.3: U1.7 15.58,70.44 15.95,70.81 v2(15.95,71.19) ; SW1.2 18.16,59.89 v2(16.84,59.89)
  Top Layer w0.5: SW1.2 18.16,57.27 16.85,55.96 C6.1 15.82,54.17 16.71,53.28 18.16,53.28 SW1.1 19.38,53.28 19.89,52.77 19.89,51.26 R3.1
  CPU1 w0.3: v2(16.84,59.89) 15.95,60.77 v2(15.95,71.19)
OSC32_IN: length 9.7
  Top Layer w0.3: Y1.2 19.5,63.41 C2.2 19.5,64.97 19.5,65.98 18.74,66.74 17.35,66.74 15.65,68.44 U1.3
OSC32_OUT: length 12
  Top Layer w0.3: Y1.1 21.42,62.83 C3.2 21.41,64.97 21.41,66.62 20.65,67.38 17.47,67.38 15.91,68.94 U1.4
OSC_IN: length 7.9
  Top Layer w0.254: C4.2 18.35,68.65 17.22,68.65 16.43,69.44 U1.5
  Top Layer w0.3: Y2.2 20.89,68.66 C4.2
OSC_OUT: length 9.7
  Top Layer w0.254: C5.2 20.85,72.72 Y2.1
  Top Layer w0.3: U1.6 16.22,69.94 16.71,70.43 16.71,72.08 17.35,72.71 18.35,72.71 C5.2
PWR_EN: length 51.8
  Top Layer w0.3: v2(2.36,32.33) 2.36,30.63 D2.2 ; U1.33 1.66,74.94 1.34,75.25 v2(1.34,75.89)
  CPU2 w0.3: v2(3.25,62.3) 2.9,62.3 0.58,59.98 0.58,34.1 v2(2.36,32.33)
  Bottom Layer w0.3: v2(3.25,62.3) 3.25,73.98 v2(1.34,75.89)
REDL: length 51.3
  Top Layer w0.3: U1.56 8.21,72.34 v2(8.84,72.97) ; v2(6.93,109.67) 7.69,110.43 R7.2
  CPU2 w0.3: v2(6.93,109.67) 5.03,109.67 4.26,108.91 4.26,105.61 3.5,104.84 3.5,100.91 8.46,95.95 8.46,73.35 v2(8.84,72.97)
RX1: length 16.7
  Top Layer w0.3: U1.43 0.86,69.94 v2(0.84,69.92)
  CPU2 w0.3: v2(0.84,69.92) 2.11,71.19 2.11,83.13 1.34,83.89
RX6: length 20.4
  Top Layer w0.3: v2(10.62,73.73) 7.82,73.73 6.53,72.44 U1.38
  Bottom Layer w0.3: 20.9,77.81 20.88,77.79 17.35,77.79 13.28,73.73 v2(10.62,73.73)
SOUNDCARD: length 14.6
  Top Layer w0.3: R18.2 12.01,87.95 8.84,84.78 8.84,83.25 6.55,80.97 6.55,79.32 6.21,78.97 U1.29
SW_EN: length 19.3
  Top Layer w0.3: D2.1 8.03,29.36 D1.1
  Top Layer w0.5: v1(12.14,18.48) R14.2 10.73,15.58 10.42,15.27 ; v1(11,26.61) D1.1
  Bottom Layer w0.5: v1(12.14,18.48) 12.14,25.47 v1(11,26.61)
SWCLK: length 6.4
  Top Layer w0.3: U1.49 4.71,63.63 v2(4.14,63.06)
  CPU1 w0.3: v2(4.14,63.06) 4.14,60.01 CN1.3
SWDIO: length 13.7
  Top Layer w0.3: U1.46 1.3,68.44 v2(0.96,68.78)
  CPU2 w0.3: CN1.2 7.19,62.55 v2(0.96,68.78)
TX1: length 19.5
  Top Layer w0.3: U1.42 1.46,70.44 v2(0.84,71.06)
  CPU1 w0.3: 1.34,86.43 3.25,84.52 3.25,82.87 0.58,80.2 0.58,71.31 v2(0.84,71.06)
TX6: length 21.3
  Top Layer w0.3: v2(9.6,74.49) 7.82,74.49 6.27,72.94 U1.37
  Bottom Layer w0.3: 20.9,80.31 20.88,80.33 19,80.33 13.16,74.49 v2(9.6,74.49)
USB+: length 12.3
  Bottom Layer w1: 19.62,33.98 18.11,32.47 18.11,25.72 USB1.1
UVL: length 54.7
  Top Layer w0.3: U1.57 8.71,71.82 v2(9.85,72.97) ; v2(14.17,110.43) R11.2
  CPU1 w0.3: v2(9.85,72.97) 12.01,72.97 18.11,79.06 18.11,109.29 16.97,110.43 v2(14.17,110.43)
$1N1304: length 3.9
  Top Layer w0.3: U1.30 5.71,80.55 C1.1
$1N1668: length 4.7
  Top Layer w0.3: R1.1 7.95,62.43 7.95,63.19 8.46,63.7 9.73,63.7 10.21,64.18 U1.60
$1N1829: length 8.4
  Top Layer w0.3: R2.1 9.6,84.13 9.6,83.25 7,80.66 7,79.01 6.71,78.71 U1.28
$1N9984: length 5.7
  Top Layer w0.5: Q1.3 7.76,114.82 8.46,115.51 9.98,115.51 10.73,116.26 CN2.2
$1N10713: length 5.9
  Top Layer w0.5: 12.01,112.65 12.01,110.81 11.63,110.43 R7.1 ; 12.01,112.65 11.89,112.53 Q1.1 ; 12.01,112.65 R6.2
$1N11694: length 5.5
  Top Layer w0.5: CN3.2 3.74,116.51 2.87,115.64 1.72,115.64 1.08,115 Q2.3
$1N11697: length 7.3
  Top Layer w0.5: R9.1 4.9,110.43 5.66,111.19 R8.2 5.47,112.66 Q2.1
$1N12643: length 5.3
  Top Layer w0.5: Q3.3 14.42,114.87 15.06,115.51 15.95,115.51 16.82,116.38 CN4.2
$1N12646: length 5.9
  Top Layer w0.5: R11.1 18.36,110.43 18.87,110.94 18.87,112.46 18.8,112.53 ; 18.8,112.53 R10.2 ; 18.8,112.53 Q3.1
$1N15476: length 6.7
  Top Layer w0.7: L1.1 6.04,18.1 8.52,15.62 8.52,15.27
$1N15617: length 13.7
  Top Layer w0.7: U5.5 10.66,13.06 12.77,15.17 R13.2 13.41,21.02 12.77,21.66 R12.1 C13.1
$1N23471: length 16.7
  Top Layer w0.5: 15.87,37.57 14.89,38.56 R16.1 13.21,38.49 Q4.1 10.88,33.88 D1.2
  Bottom Layer w0.5: 15.87,37.57 22.37,37.57
$1N28745: length 4.1
  Top Layer w0.7: R19.2 10.04,92.45 Q5.1 12,90.63 R18.1
$1N30076: length 11.8
  Top Layer w0.7: 1.34,94.05 2.87,94.05 4.26,92.65 4.26,89.73 5.66,88.33 9.08,88.33 Q5.3
$1N30362: length 30.9
  Top Layer w0.5: 22.68,88.97 21.66,88.97 19.38,91.25 19.38,108.02 20.65,109.29 20.65,117.18 CN8.1
$1N30425: length 34.1
  Top Layer w0.5: CN8.2 22.55,117.27 v1(22.55,112.59)
  Bottom Layer w0.5: 22.68,86.43 21.66,86.43 19.38,88.71 19.38,108.15 22.55,111.32 v1(22.55,112.59)
